# EAGLE design ESP32_breakout (EAGLE 9.1.1)
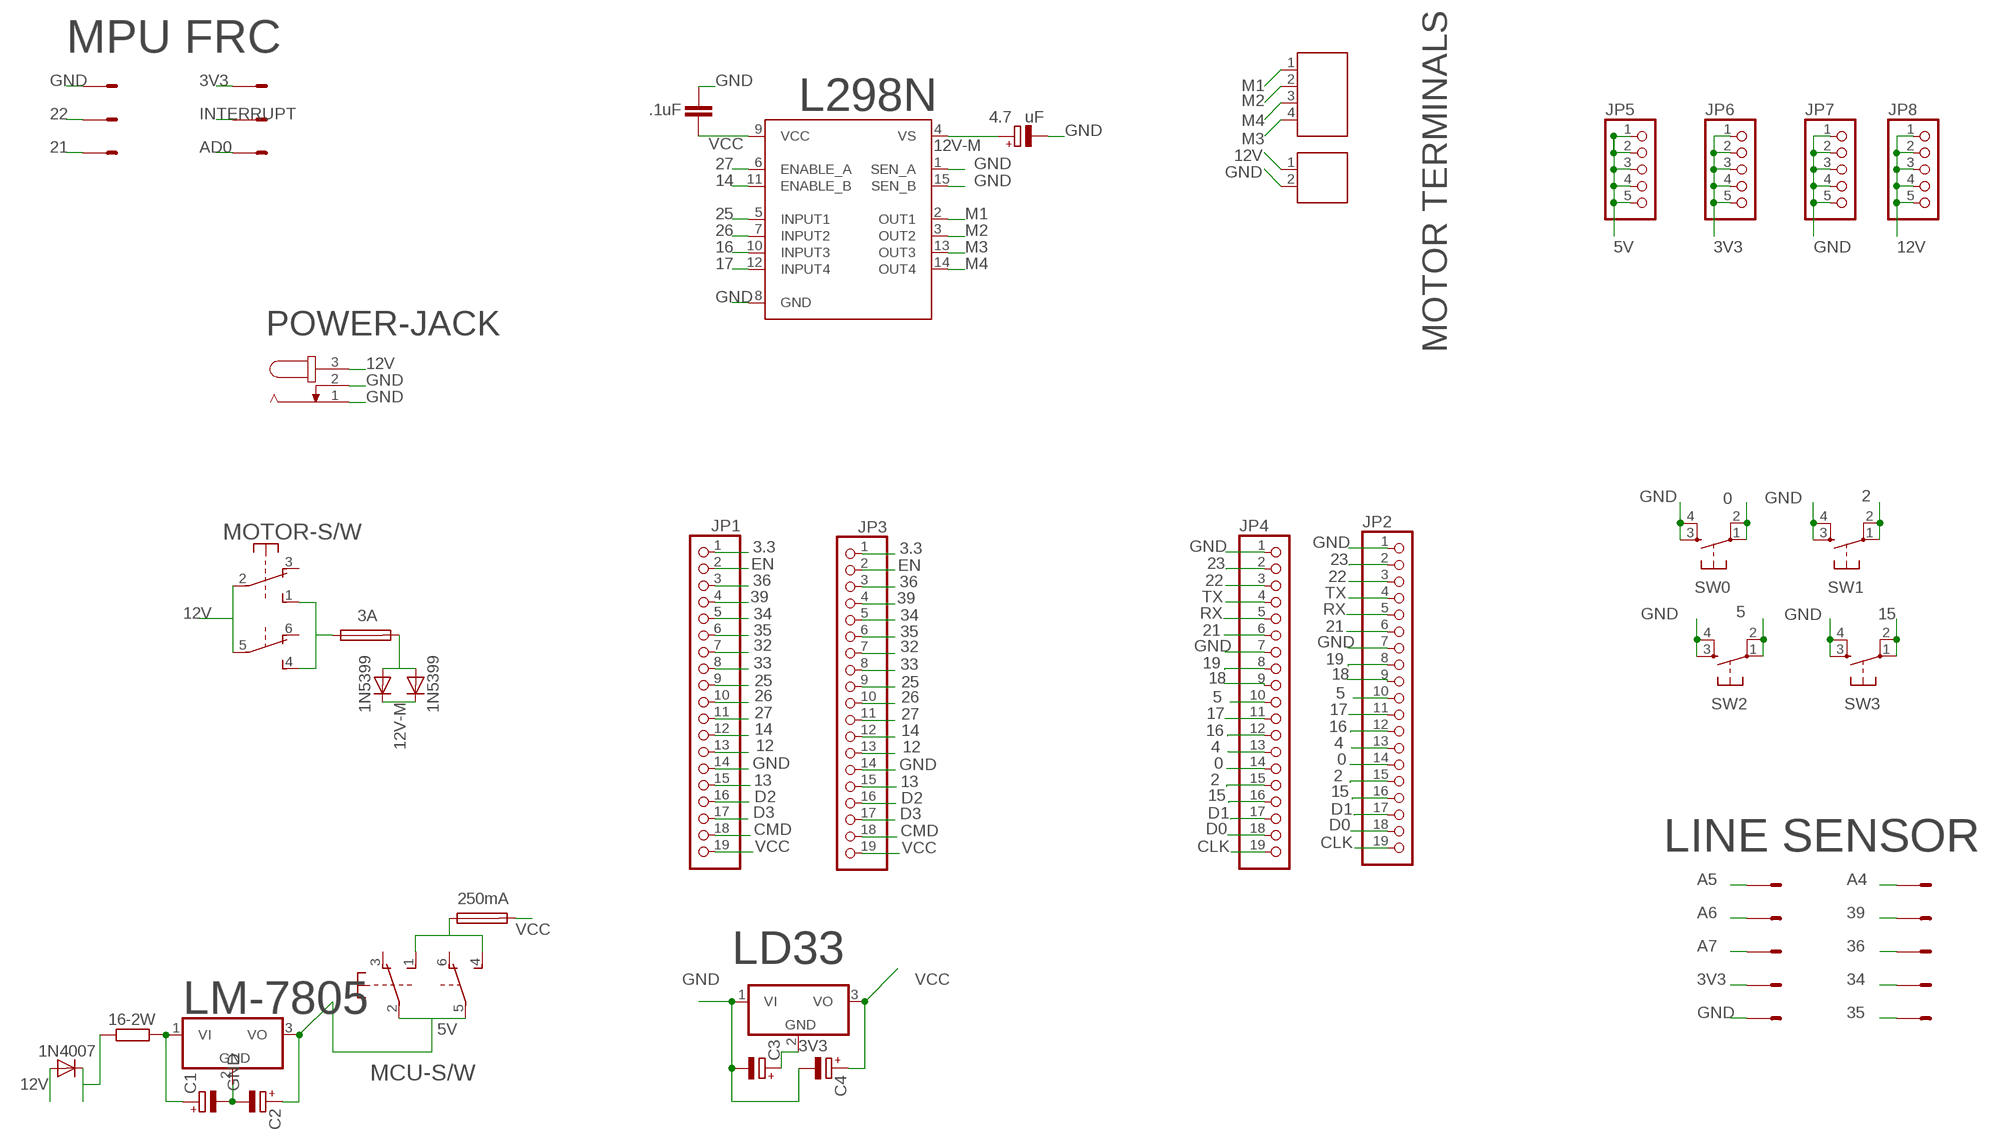
[diagram p0: schematic, sheet 1]

## Parts
12V  691131710002  [691131710002]
16-2W  R-EU_0617/17  [0617/17]
C1  CPOL-EUE2.5-6  [E2,5-6]
C2  CPOL-EUE2.5-6  [E2,5-6]
C3  CPOL-EUE2.5-6  [E2,5-6]
C4  CPOL-EUE2.5-6  [E2,5-6]
C8  4.7 uF  CPOL-EUE2.5-6  [E2,5-6]
C9  .1uF  C5/2.5  [C5B2.5]
D4  1N4007  DIODE-D-7.5  [D-7.5]
D6  1N5399  DIODE-DO15-12  [DO15-12]
D7  1N5399  DIODE-DO15-12  [DO15-12]
F1  3A  SH25  [SH25]
F2  250mA  SH25  [SH25]
J1  691131710004  [691131710004]
JP1  PINHD-1X19  [1X19]
JP2  PINHD-1X19  [1X19]
JP3  PINHD-1X19  [1X19]
JP4  PINHD-1X19  [1X19]
JP5  PINHD-1X5  [1X05]
JP6  PINHD-1X5  [1X05]
JP7  PINHD-1X5  [1X05]
JP8  PINHD-1X5  [1X05]
L298N  L298  [MULTIWATT-15]
LD33  786TV  [TO220V]
LINE-SENSOR  057-010-1  [057-010-1]
LM-7805  786TV  [TO220V]
MCU-S/W  9077-2  [9077-2]
MOTOR-S/W  9077-2  [9077-2]
MPU-6050  057-006-1  [057-006-1]
POWER-JACK  JACK-PLUG1  [SPC4078]
SW0  DTS-6  [DTS-6]
SW1  DTS-6  [DTS-6]
SW2  DTS-6  [DTS-6]
SW3  DTS-6  [DTS-6]

## Nets
0: JP2.14 JP4.14 SW0.1 SW0.2
2: JP2.15 JP4.15 SW1.1 SW1.2
3.3: JP1.1 JP3.1
3V3: C3.+ JP6.1 JP6.2 JP6.3 JP6.4 JP6.5 LD33.2(GND) LINE-SENSOR.7 MPU-6050.2
4: JP2.13 JP4.13
5: JP2.10 JP4.10 SW2.1 SW2.2
5V: C2.+ JP5.1 JP5.2 JP5.3 JP5.4 JP5.5 LM-7805.3(VO) MCU-S/W.2(1:P) MCU-S/W.5(2:P)
12: JP1.13 JP3.13
12V: 12V.1 D4.A JP8.1 JP8.2 JP8.3 JP8.4 JP8.5 MOTOR-S/W.2(1:P) MOTOR-S/W.5(2:P) POWER-JACK.3
12V-M: C8.+ D6.C D7.C L298N.4(VS)
13: JP1.15 JP3.15
14: JP1.12 JP3.12 L298N.11(ENABLE_B)
15: JP2.16 JP4.16 SW3.1 SW3.2
16: JP2.12 JP4.12 L298N.10(INPUT3)
17: JP2.11 JP4.11 L298N.12(INPUT4)
18: JP2.9 JP4.9
19: JP2.8 JP4.8
21: JP2.6 JP4.6 MPU-6050.5
22: JP2.3 JP4.3 MPU-6050.3
23: JP2.2 JP4.2
25: JP1.9 JP3.9 L298N.5(INPUT1)
26: JP1.10 JP3.10 L298N.7(INPUT2)
27: JP1.11 JP3.11 L298N.6(ENABLE_A)
32: JP1.7 JP3.7
33: JP1.8 JP3.8
34: JP1.5 JP3.5 LINE-SENSOR.8
35: JP1.6 JP3.6 LINE-SENSOR.10
36: JP1.3 JP3.3 LINE-SENSOR.6
39: JP1.4 JP3.4 LINE-SENSOR.4
A4: LINE-SENSOR.2
A5: LINE-SENSOR.1
A6: LINE-SENSOR.3
A7: LINE-SENSOR.5
CLK: JP2.19 JP4.19
CMD: JP1.18 JP3.18
D0: JP2.18 JP4.18
D1: JP2.17 JP4.17
D2: JP1.16 JP3.16
D3: JP1.17 JP3.17
EN: JP1.2 JP3.2
GND: 12V.2 C1.- C2.- C3.- C4.- C8.- C9.2 JP1.14 JP2.1 JP2.7 JP3.14 JP4.1 JP4.7 JP7.1 JP7.2 JP7.3 JP7.4 JP7.5 L298N.1(SEN_A) L298N.8(GND) L298N.15(SEN_B) LD33.1(VI) LINE-SENSOR.9 LM-7805.2(GND) MPU-6050.1 MPU-6050.6 POWER-JACK.1 POWER-JACK.2 SW0.3 SW0.4 SW1.3 SW1.4 SW2.3 SW2.4 SW3.3 SW3.4
INTERRUPT: MPU-6050.4
M1: J1.1 L298N.2(OUT1)
M2: J1.2 L298N.3(OUT2)
M3: J1.4 L298N.13(OUT3)
M4: J1.3 L298N.14(OUT4)
N$1: 16-2W.2 C1.+ LM-7805.1(VI)
N$3: F1.1 MOTOR-S/W.1(1:S) MOTOR-S/W.4(2:S)
N$6: F2.1 MCU-S/W.1(1:S) MCU-S/W.4(2:S)
N$8: 16-2W.1 D4.C
N$9: D6.A D7.A F1.2
RX: JP2.5 JP4.5
TX: JP2.4 JP4.4
VCC: C4.+ C9.1 F2.2 JP1.19 JP3.19 L298N.9(VCC) LD33.3(VO)
Unconnected: MCU-S/W.3(1:O) MCU-S/W.6(2:O) MOTOR-S/W.3(1:O) MOTOR-S/W.6(2:O)

## Notes on the sheet
- MPU FRC
- AD0
- MOTOR TERMINALS
- LINE SENSOR

## Library data of the parts
12V = Wurth_Elektronik_Electromechanic_Terminal_Blocks_Connectors_rev16b:691131710002: WR-TBL Terminal block - CUU5/2 CUU5/2GR - 2 Pins;=>Code : Con_TBL_Screw_PClamp_5.00_6911317100xx_691131710002 <http://katalog.we-online.de/media/images/eican/Con_TBL_Screw_PClamp_5.00_6911317100xx_pf2.jpg> Details see: http://katalog.we-online.de/em/datasheet/6911317100xx.pdf Created 11/23/2014, Karrer Zheng 2014 (C) Wurth Elektronik
16-2W = resistor:R-EU_: RESISTOR, European symbol
C1-C4 = rcl:CPOL-EU: POLARIZED CAPACITOR, European symbol; SPICEPREFIX: C
C8 = rcl:CPOL-EU: POLARIZED CAPACITOR, European symbol
C9 = capacitor-wima:C: CAPACITOR naming: grid - package width
D4 D6 D7 = diode:DIODE-: DIODE
F1 F2 = fuse:SH25: FUSE HOLDER grid 25 mm, OGN0031 8211, Schurter (Buerklin); MF: SCHURTER; MPN: 0031.8211; OC_FARNELL: 1162741; OC_NEWARK: 96B9380
J1 = Wurth_Elektronik_Electromechanic_Terminal_Blocks_Connectors_rev16b:691131710004: WR-TBL Terminal block - CUU5/4 - 4 Pins;=>Code : Con_TBL_Screw_PClamp_5.00_6911317100xx_691131710004 <http://katalog.we-online.de/media/images/eican/Con_TBL_Screw_PClamp_5.00_6911317100xx_pf2.jpg> Details see: http://katalog.we-online.de/em/datasheet/6911317100xx.pdf Created 11/3/2014, Karrer Zheng 2014 (C) Wurth Elektronik
JP1-JP4 = pinhead:PINHD-1X19: PIN HEADER
JP5-JP8 = pinhead:PINHD-1X5: PIN HEADER
L298N = st-microelectronics:L298: DUAL FULL-BRIDGE DRIVER; MPN: L298N; OC_FARNELL: 1589425; OC_NEWARK: 32M1527
LD33 LM-7805 = linear:78*: Positive VOLTAGE REGULATOR Source: http://cache.national.com/ds/LM/LM78L05.pdf http://www.fairchildsemi.com/ds/LM/LM7805.pdf
LINE-SENSOR = con-panduit:057-010-: CONNECTOR 10-pin series 057 contact pc board low profile headers; OC_FARNELL: unknown; OC_NEWARK: unknown
MCU-S/W MOTOR-S/W = switch-misc:9077-2: MARQUARDT SWITCH 9077.0200 Distributor: Buerklin <https://www.buerklin.com/default.asp?event=ShowArtikel%2812G2822%29&l=d&jump=ArtNr_12G2822>
MPU-6050 = con-panduit:057-006-: CONNECTOR 6-pin series 057 contact pc board low profile headers; OC_FARNELL: unknown; OC_NEWARK: unknown
POWER-JACK = con-jack:JACK-PLUG: DC POWER JACK Power Jack, DC, Right Angle, Through Hole, Rated 5A at 16VDC, PC Terminals Distributor: Farnell (www.Farnell.de) Drawing: 84N1161.pdf / 84N1162.pdf Manufacturer: SPC Technology (www.spctechnology.com) Type: SPC4077 / SPC 4078; OC_FARNELL: unknown; OC_NEWARK: unknown
SW0 SW1-SW3 = switch-tact:DTS-6

## Net classes
0 default: clearance 0.205 mm

## Board
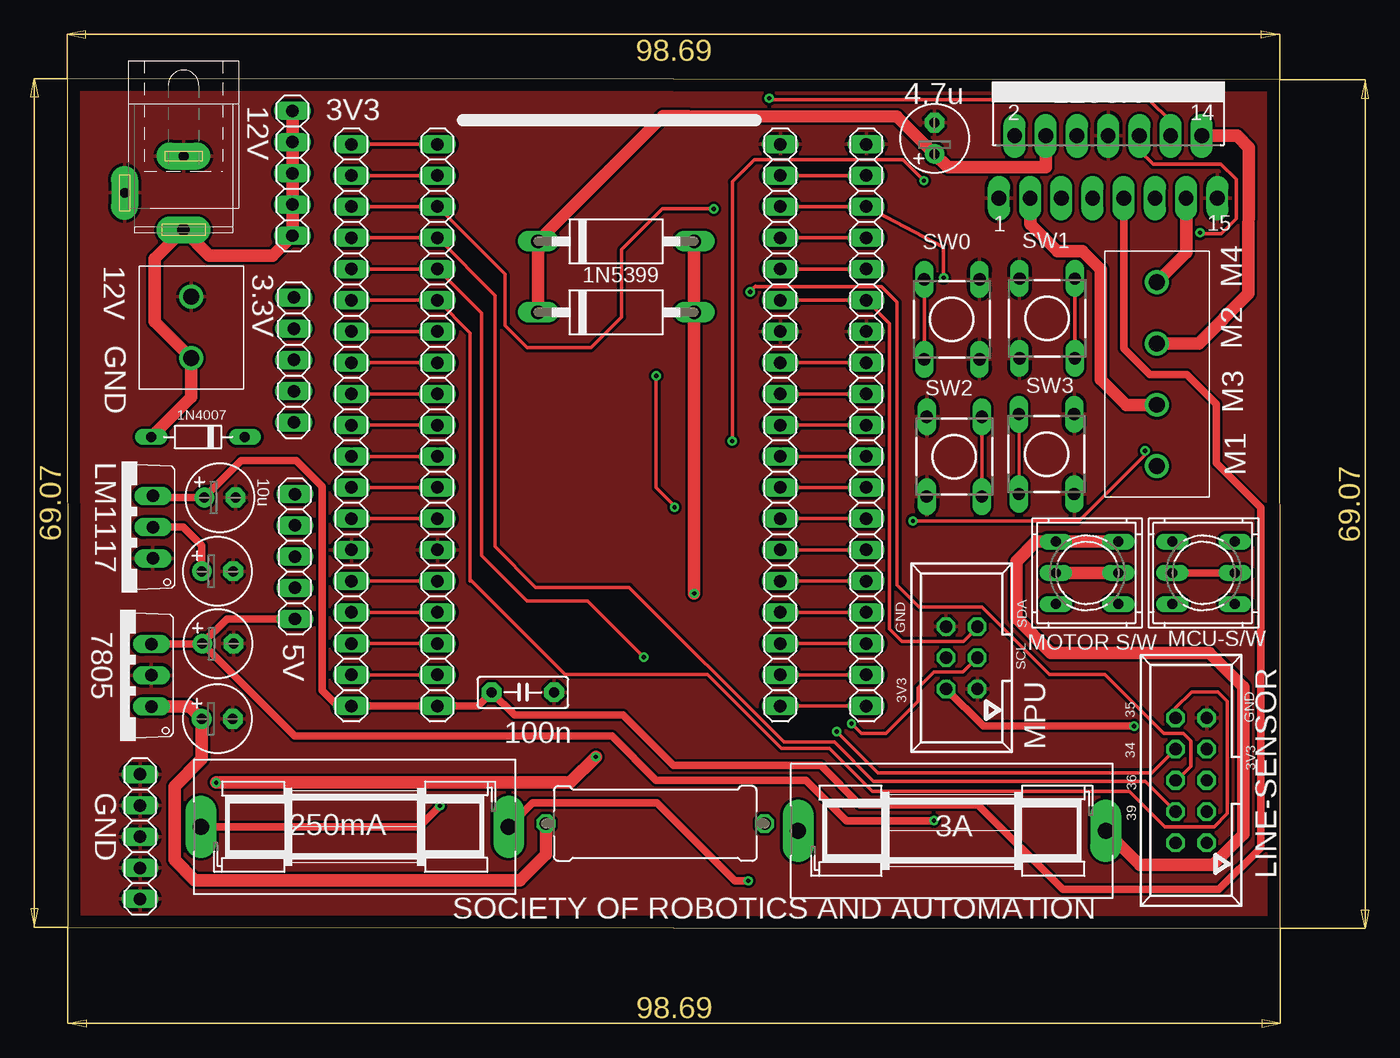
[diagram p1: board, top side]
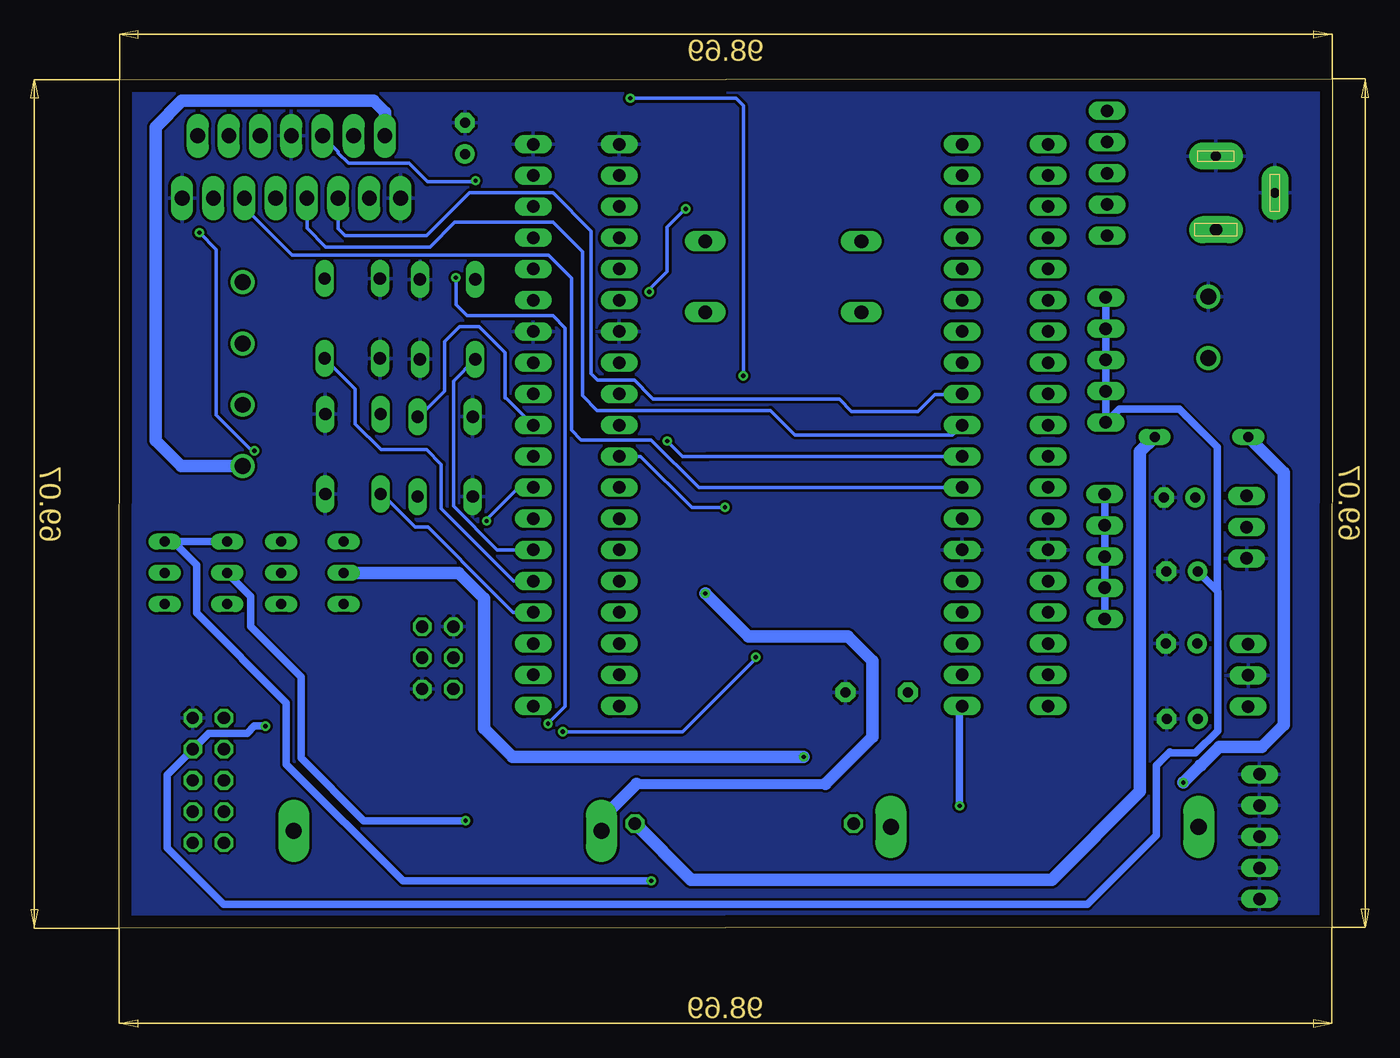
[diagram p2: board, bottom side, seen from below]

Size 98.73 x 69.17 mm. Coordinates in mm from the lower left corner, seen from the top.
Outline: 0.04,0.1 98.73,0 98.69,69.07 0,69.17 0.04,0.1
Copper layers (1*16): Top 0.035mm / dielectric 1.5mm / Bottom 0.035mm
Design rules "default *": minimum track width 6mil, minimum drill 0.35mm, track to track 4mil, track to pad 4mil, pad to pad 4mil, via to via 4mil, smd to smd 6mil, copper to edge 40mil, drill to drill 6mil, minimum pad ring 10mil, minimum via ring 8mil, stop-mask expansion 4mil, vias tented up to drill 0mil, thermal gap 10mil

### Footprints (pad centres in the part's own frame; a part is rotated, then mirrored left to right if it is on the bottom)
691131710002 = drill 1.3: 1 -2.5,0; 2 2.5,0
0617/17 = drill 1.016 octagon: 1 -8.89,0; 2 8.89,0
E2,5-6 = drill 0.813 pad 1.6: + -1.27,0 | drill 0.813 pad 1.6 octagon: - 1.27,0
C5B2.5 = drill 0.813 pad 1.6 octagon: 1 -2.54,0; 2 2.54,0
D-7.5 = drill 0.813 long: A 3.81,0; C -3.81,0
DO15-12 = drill 1.118 long: A 6.35,0; C -6.35,0
SH25 = drill 1.321 pad 2.54 long: 1 -12.522,0; 2 12.522,0
691131710004 = drill 1.3: 1 -7.5,0; 2 -2.5,0; 3 2.5,0; 4 7.5,0
1X19 = drill 1.016 long: 1 -22.86,0; 2 -20.32,0; 3 -17.78,0; 4 -15.24,0; 5 -12.7,0; 6 -10.16,0; 7 -7.62,0; 8 -5.08,0; 9 -2.54,0; 10 0,0; 11 2.54,0; 12 5.08,0; 13 7.62,0; 14 10.16,0; 15 12.7,0; 16 15.24,0; 17 17.78,0; 18 20.32,0; 19 22.86,0
1X05 = drill 1.016 long: 1 -5.08,0; 2 -2.54,0; 3 0,0; 4 2.54,0; 5 5.08,0
MULTIWATT-15 = drill 1.2 long: 1 -8.89,-7.62; 2 -7.62,-2.54; 3 -6.35,-7.62; 4 -5.08,-2.54; 5 -3.81,-7.62; 6 -2.54,-2.54; 7 -1.27,-7.62; 8 0,-2.54; 9 1.27,-7.62; 10 2.54,-2.54; 11 3.81,-7.62; 12 5.08,-2.54; 13 6.35,-7.62; 14 7.62,-2.54; 15 8.89,-7.62
TO220V = drill 1.016 long: 1 -2.54,-2.54; 2 0,-2.54; 3 2.54,-2.54
057-010-1 = drill 1 octagon: 1 -5.08,-1.27; 2 -5.08,1.27; 3 -2.54,-1.27; 4 -2.54,1.27; 5 0,-1.27; 6 0,1.27; 7 2.54,-1.27; 8 2.54,1.27; 9 5.08,-1.27; 10 5.08,1.27
9077-2 = drill 0.813 long: 1 -2.54,2.54; 2 0,2.54; 3 2.54,2.54; 4 -2.54,-2.54; 5 0,-2.54; 6 2.54,-2.54
057-006-1 = drill 1 octagon: 1 -2.54,-1.27; 2 -2.54,1.27; 3 0,-1.27; 4 0,1.27; 5 2.54,-1.27; 6 2.54,1.27
SPC4078 = drill 0.8 pad 2.184 long: 1 -3,0; 2 0,-4.8 | drill 1 pad 2.184 long: 3 3,0
DTS-6 = drill 1 long: 1 -3.25,2.25; 2 3.25,2.25; 3 -3.25,-2.25; 4 3.25,-2.25

### Placement (x,y rotation side)
12V  10.09,48.9 90 top
16-2W  47.85,8.53 180 top
C1  12.2,17.05 0 top
C2  12.26,23.17 0 top
C3  12.22,29.06 0 top
C4  12.42,35.06 0 top
C8  70.58,64.3 90 top
C9  37.07,19.21 0 top
D4  10.64,39.99 180 top
D6  44.67,50.14 0 top
D7  44.67,55.92 0 top
F1  71.99,7.94 180 top
F2  23.39,8.26 180 top
J1  88.68,45.11 90 top
JP1  23.12,40.96 270 top
JP2  65.02,40.96 270 top
JP3  30.12,40.96 270 top
JP4  58.02,40.96 270 top
JP5  18.52,30.26 270 top
JP6  18.42,46.26 90 top
JP7  5.92,7.46 270 top
JP8  18.32,61.46 90 top
L298N  84.71,67.05 0 top
LD33  4.42,32.66 90 top
LINE-SENSOR  91.46,12.04 90 top
LM-7805  4.3,20.59 90 top
MCU-S/W  92.47,28.93 270 top
MOTOR-S/W  83,28.93 270 top
MPU-6050  72.79,22.02 90 top
POWER-JACK  9.46,59.86 270 top
SW0  71.99,49.57 90 top
SW1  79.75,49.64 270 top
SW2  72.19,38.39 270 top
SW3  79.69,38.6 90 top

### Tracks (layer width: path | path; a pad name or v marks a point on that pad's centre or on a via)
0
  Top 0.305: JP4.14 64.22,30.8 JP2.14 | SW0.1 SW0.2
  Bottom 0.305: SW0.1 71.52,44.54 71.52,34.36 67.96,30.8 JP2.14
2
  Top 0.305: JP2.15 JP4.15 | SW1.2 SW1.1
  Bottom 0.305: JP2.15 66.62,28.26 72.52,34.16 72.52,37.76 73.72,38.96 77.42,38.96 79.52,41.06 79.52,43.91 SW1.2
3.3
  Top 0.305: JP1.1 JP3.1
3V3  (via drill 0.35)
  Top 0.61: LD33.2 9.42,32.66 10.92,31.16 10.92,29.09 C3.+ | MPU-6050.2 74.54,16.46 v86.82,16.46
  Bottom 0.61: JP6.5 JP6.4 JP6.3 JP6.2 JP6.1 17.34,42.26 12.42,42.26 9.33,39.18 9.33,27.45 | v86.82,16.46 87.72,16.46 88.32,15.86 89.66,15.86 89.67,15.86 90.71,15.86 90.72,15.86 91.45,15.86 LINE-SENSOR.7 94.82,12.49 94.82,6.56 90.22,1.96 19.92,1.96 14.32,7.56 14.32,13.26 13.22,14.36 13.12,14.26 11.12,14.26 9.32,16.06 9.32,27.43 9.33,27.45 | 9.33,27.45 C3.+
4
  Top 0.305: JP2.13 JP4.13
5
  Top 0.305: JP4.10 JP2.10 | SW2.1 SW2.2
  Bottom 0.305: SW2.1 74.32,41.64 72.22,43.74 72.22,47.76 71.02,48.96 69.42,48.96 67.32,46.86 67.32,43.16 67.22,43.16 JP2.10
5V  (via drill 0.35)
  Top 0.61: MCU-S/W.5 MCU-S/W.2 | LM-7805.3 10.95,23.13 C2.+ | JP5.5 13,25.18 C2.+ | C2.+ 18.5,15.66 44.32,15.66 47.92,12.06 60.12,12.06 63.42,8.76 v70.52,8.76
  Bottom 0.61: MCU-S/W.5 88.02,27.02 88.02,24.56 83.92,20.46 83.92,13.86 78.82,8.76 v70.52,8.76 | JP5.1 JP5.2 JP5.3 JP5.4 JP5.5
12
  Top 0.305: JP1.13 25.12,33.34 JP3.13
12V  (via drill 0.35)
  Top 1.016: MOTOR-S/W.2 MOTOR-S/W.5 | JP8.5 JP8.4 JP8.3 JP8.2 JP8.1 16.7,54.76 11.56,54.76 POWER-JACK.3 7.12,54.52 7.12,49.37 12V.1 10.09,43.25 D4.A | v12.12,11.86 39.92,11.86 40.92,11.86 v43.02,13.96
  Bottom 1.016: v43.02,13.96 66.72,13.96 69.02,16.26 69.02,26.86 71.09,28.93 MOTOR-S/W.5 | D4.A 3.92,37.08 3.92,16.56 5.72,14.76 9.18,14.76 10.7,13.24 10.74,13.24 v12.12,11.86
12V-M
  Top 1.016: D6.C D7.C 48.49,66.09 50.52,66.09 67.53,66.08 C8.+ 71.67,61.94 79.63,61.94 L298N.4
13
  Top 0.305: JP3.15 JP1.15
14
  Top 0.305: JP3.12 JP1.12
  Bottom 0.305: JP3.12 51.54,35.88 55.42,39.76 61.12,39.76 61.92,40.56 61.92,52.91 63.79,54.78 84.64,54.78 88.52,58.66 L298N.11
15
  Top 0.254: SW3.2 SW3.1
  Top 0.305: JP4.16 JP2.16
  Bottom 0.305: JP2.16 66.68,25.72 68.15,27.2 68.15,27.22 73.59,32.66 74.62,32.66 77.31,35.35 SW3.1
16  (via drill 0.35)
  Top 0.305: JP4.12 JP2.12 | L298N.10 87.25,63.31 88.37,62.19 93.89,62.19 95.12,60.96 95.12,57.76 93.92,56.56 92.23,56.56 v92.18,56.62 | v68.82,33.16 82.32,33.16 87.72,38.56 v87.72,38.85 v87.72,38.86
  Bottom 0.305: v92.18,56.62 90.82,55.26 90.82,41.76 87.82,38.76 v87.72,38.86 | JP2.12 66.2,35.88 68.82,33.26 68.92,33.26 v68.82,33.16
17  (via drill 0.35)
  Top 0.305: JP2.11 JP4.11 | L298N.12 89.79,65.69 88.02,67.46 57.32,67.46 57.22,67.36 57.22,67.46 v57.12,67.56 | v47.92,44.96 47.92,35.86 49.52,34.26 v49.42,34.26
  Bottom 0.305: v47.92,44.96 47.92,66.96 48.52,67.56 v57.12,67.56 | v49.42,34.26 52.12,34.26 56.28,38.42 JP4.11
18
  Top 0.305: JP2.9 JP4.9
19
  Top 0.305: JP4.8 JP2.8
21
  Top 0.305: JP4.6 JP2.6 66.92,49.22 66.92,24.36 67.92,23.36 72.92,23.36 74.06,24.5 MPU-6050.5
22  (via drill 0.35)
  Top 0.305: JP4.3 JP2.3 71.32,55.44 v71.32,52.96 | v63.82,16.66 64.62,15.86 66.62,15.86 69.22,18.46 69.22,19.56 70.52,20.86 72.9,20.86 MPU-6050.3
  Bottom 0.305: v71.32,52.96 71.32,50.76 70.42,49.86 63.42,49.86 62.43,48.87 62.43,18.05 v63.82,16.66
23
  Top 0.305: JP4.2 JP2.2
25
  Top 0.305: JP1.9 JP3.9
  Bottom 0.254: 30.16,43.46 JP3.9
  Bottom 0.305: JP3.9 30.16,43.46 32.32,43.46 33.72,42.06 39.12,42.06 40.12,43.06 55.27,43.06 56.14,43.93 56.14,43.96 56.79,44.62 59.78,44.62 60.32,45.16 60.32,56.76 63.42,59.86 70.22,59.86 73.72,56.36 80.32,56.36 80.92,56.96 80.92,59.41 L298N.5
26
  Top 0.305: JP3.10 JP1.10
  Bottom 0.305: JP3.10 30.92,40.16 43.72,40.16 45.37,41.81 45.72,42.16 59.82,42.16 61.02,43.36 61.02,55.06 63.42,57.46 71.42,57.46 73.42,55.46 81.92,55.46 83.44,56.98 L298N.7
27  (via drill 0.35)
  Top 0.305: JP1.11 JP3.11 | v54.12,39.66 54.12,60.76 55.92,62.56 68.02,62.56 v69.72,60.86
  Bottom 0.305: JP3.11 50.72,38.42 | 50.72,38.42 50.88,38.42 50.72,38.42 | v54.12,39.66 52.88,38.42 50.72,38.42 | v69.72,60.86 69.82,60.76 73.62,60.76 75.12,62.26 80.06,62.26 80.89,63.09 80.89,63.23 L298N.6
32
  Top 0.305: JP1.7 JP3.7
  Bottom 0.254: 30.2,48.66 JP3.7
  Bottom 0.305: JP3.7 30.2,48.66
33
  Top 0.305: JP3.8 JP1.8
34  (via drill 0.35)
  Top 0.305: JP1.5 JP3.5 33.72,50.06 33.72,30.36 37.42,26.66 42.32,26.66 v46.92,22.06 | v62.62,16 65.97,12.64 88.25,12.64 LINE-SENSOR.8
  Bottom 0.305: v62.62,16 52.88,16 47.02,21.86 47.02,21.96 v46.92,22.06
35
  Top 0.305: JP1.6 JP3.6 32.78,48.46 32.78,28.26 32.92,28.26 40.52,20.66 52.1,20.66 58.11,14.65 62.03,14.65 65.52,11.16 86.42,11.16 86.47,11.11 89.31,8.27 93.33,8.27 94.42,9.36 94.42,18.26 94.42,18.46 93.62,19.26 91.52,19.26 90.19,17.93 LINE-SENSOR.10
36  (via drill 0.35)
  Top 0.305: JP1.3 JP3.3 35.62,53.24 35.62,49.06 37.42,47.26 42.62,47.26 45.12,49.76 45.12,55.26 48.42,58.56 v52.62,58.56 | v55.57,51.81 56.02,52.26 56.04,52.24 66.25,52.24 67.52,50.97 67.52,27.96 69.32,26.16 74.42,26.16 79.92,20.66 84.42,20.66 89.22,15.86 90.82,15.86 91.42,15.26 91.42,13.16 90.3,12.04 LINE-SENSOR.6
  Bottom 0.305: v52.62,58.56 54.12,57.06 54.12,53.46 55.62,51.96 55.62,51.86 v55.57,51.81
39
  Top 0.305: JP1.4 JP3.4 34.82,51.5 34.82,31.06 38.12,27.76 45.72,27.76 58.32,15.16 62.42,15.16 65.6,11.98 87.71,11.98 LINE-SENSOR.4
CLK
  Top 0.305: JP4.19 JP2.19
CMD
  Top 0.305: JP1.18 JP3.18
D0
  Top 0.305: JP4.18 JP2.18
D1
  Top 0.305: JP2.17 JP4.17
D2
  Top 0.305: JP1.16 JP3.16
D3
  Top 0.305: JP3.17 JP1.17
EN
  Top 0.305: JP3.2 JP1.2
GND
  pour Top: 0.02,69.16 98.82,69.16 98.82,-0.04 0.02,-0.04
  pour Bottom: 0.02,69.16 98.72,69.16 98.72,0.06 0.02,0.06
M1
  Bottom 1.016: L298N.2 77.09,66.43 78.02,67.36 93.62,67.36 95.76,65.22 95.76,39.69 93.68,37.61 J1.1
M2
  Top 1.016: L298N.3 78.36,57.32 80.57,55.11 82.61,55.11 84.12,53.6 84.12,44.66 86.17,42.61 J1.2
M3
  Top 1.016: L298N.13 91.06,54.99 J1.4
M4
  Top 1.016: L298N.14 95.2,64.51 96.16,63.55 96.13,51.66 92.08,47.61 J1.3
N$1
  Top 1.016: LM-7805.1 9.93,18.05 C1.+ 10.93,13.77 8.72,11.56 8.72,5.56 10.36,3.92 36.85,3.92 38.96,6.03 16-2W.2
N$3
  Top 1.016: F1.1 87.29,5.16 93.22,5.16 95.72,7.66 95.72,19.66 92.95,22.43 80.05,22.43 77.22,25.26 77.22,29.86 78.83,31.47 MOTOR-S/W.4 MOTOR-S/W.1
N$6  (via drill 0.35)
  Top 0.61: v55.42,3.86 54.32,3.86 47.98,10.2 37.85,10.2 F2.1
  Bottom 0.61: MCU-S/W.4 MCU-S/W.1 94.33,31.47 92.42,29.56 92.42,25.66 85.12,18.36 85.12,13.36 75.62,3.86 v55.42,3.86 | v55.42,3.86 55.32,3.86 v55.42,3.86
N$8
  Bottom 1.016: 16-2W.1 52.17,3.96 39.62,3.96 22.82,3.96 15.64,11.14 15.64,38.8 D4.C
N$9  (via drill 0.35)
  Top 1.016: D7.A D6.A v51.02,27.26
  Bottom 0.813: 56.62,11.76 41.22,11.76
  Bottom 1.016: v51.02,27.26 47.52,23.76 39.42,23.76 37.42,21.76 37.42,15.56 41.22,11.76 | 56.62,11.76 59.47,8.91 F1.2
RX
  Top 0.305: JP2.5 JP4.5
TX
  Top 0.305: JP4.4 JP2.4
VCC  (via drill 0.35)
  Top 0.61: v30.32,9.96 28.62,8.26 F2.2 | LD33.3 7.1,35.06 C4.+ 14.15,38.06 18.62,38.06 20.72,35.96 20.72,19.36 21.98,18.1 JP1.19 JP3.19 33.42,18.1 C9.1 36.38,17.36 45.22,17.36 49.32,13.26 61.32,13.26 64.52,10.06 74.12,10.06 81.02,3.16 93.72,3.16 97.12,6.56 97.12,34.26 93.52,37.86 93.52,42.66 91.12,45.06 88.12,45.06 85.98,47.2 L298N.9
  Bottom 0.61: JP3.19 30.32,17.9 v30.32,9.96

### Text on the board
tSilk: 4.7u | L298N | 3V3 | SW0 | SW1 | 12V | 1N5399 | M4 | GND | M2 | SW3 | SW2 | M3 | 10u | M1 | SDA | 7805 | GND | MOTOR S/W | MCU-S/W | SCL | 3V3 | 35 | GND | 100n | MPU | 34 | 36 | 3V3 | 39 | 250mA | 3A | LINE-SENSOR | SOCIETY OF ROBOTICS AND AUTOMATION
_tsilk: 12V | 3.3V | 1N4007 | LM1117 | 5V | GND